# EAGLE design 8-BIT ONE-BUS FLASH CART PRGMER (EAGLE 5.11)
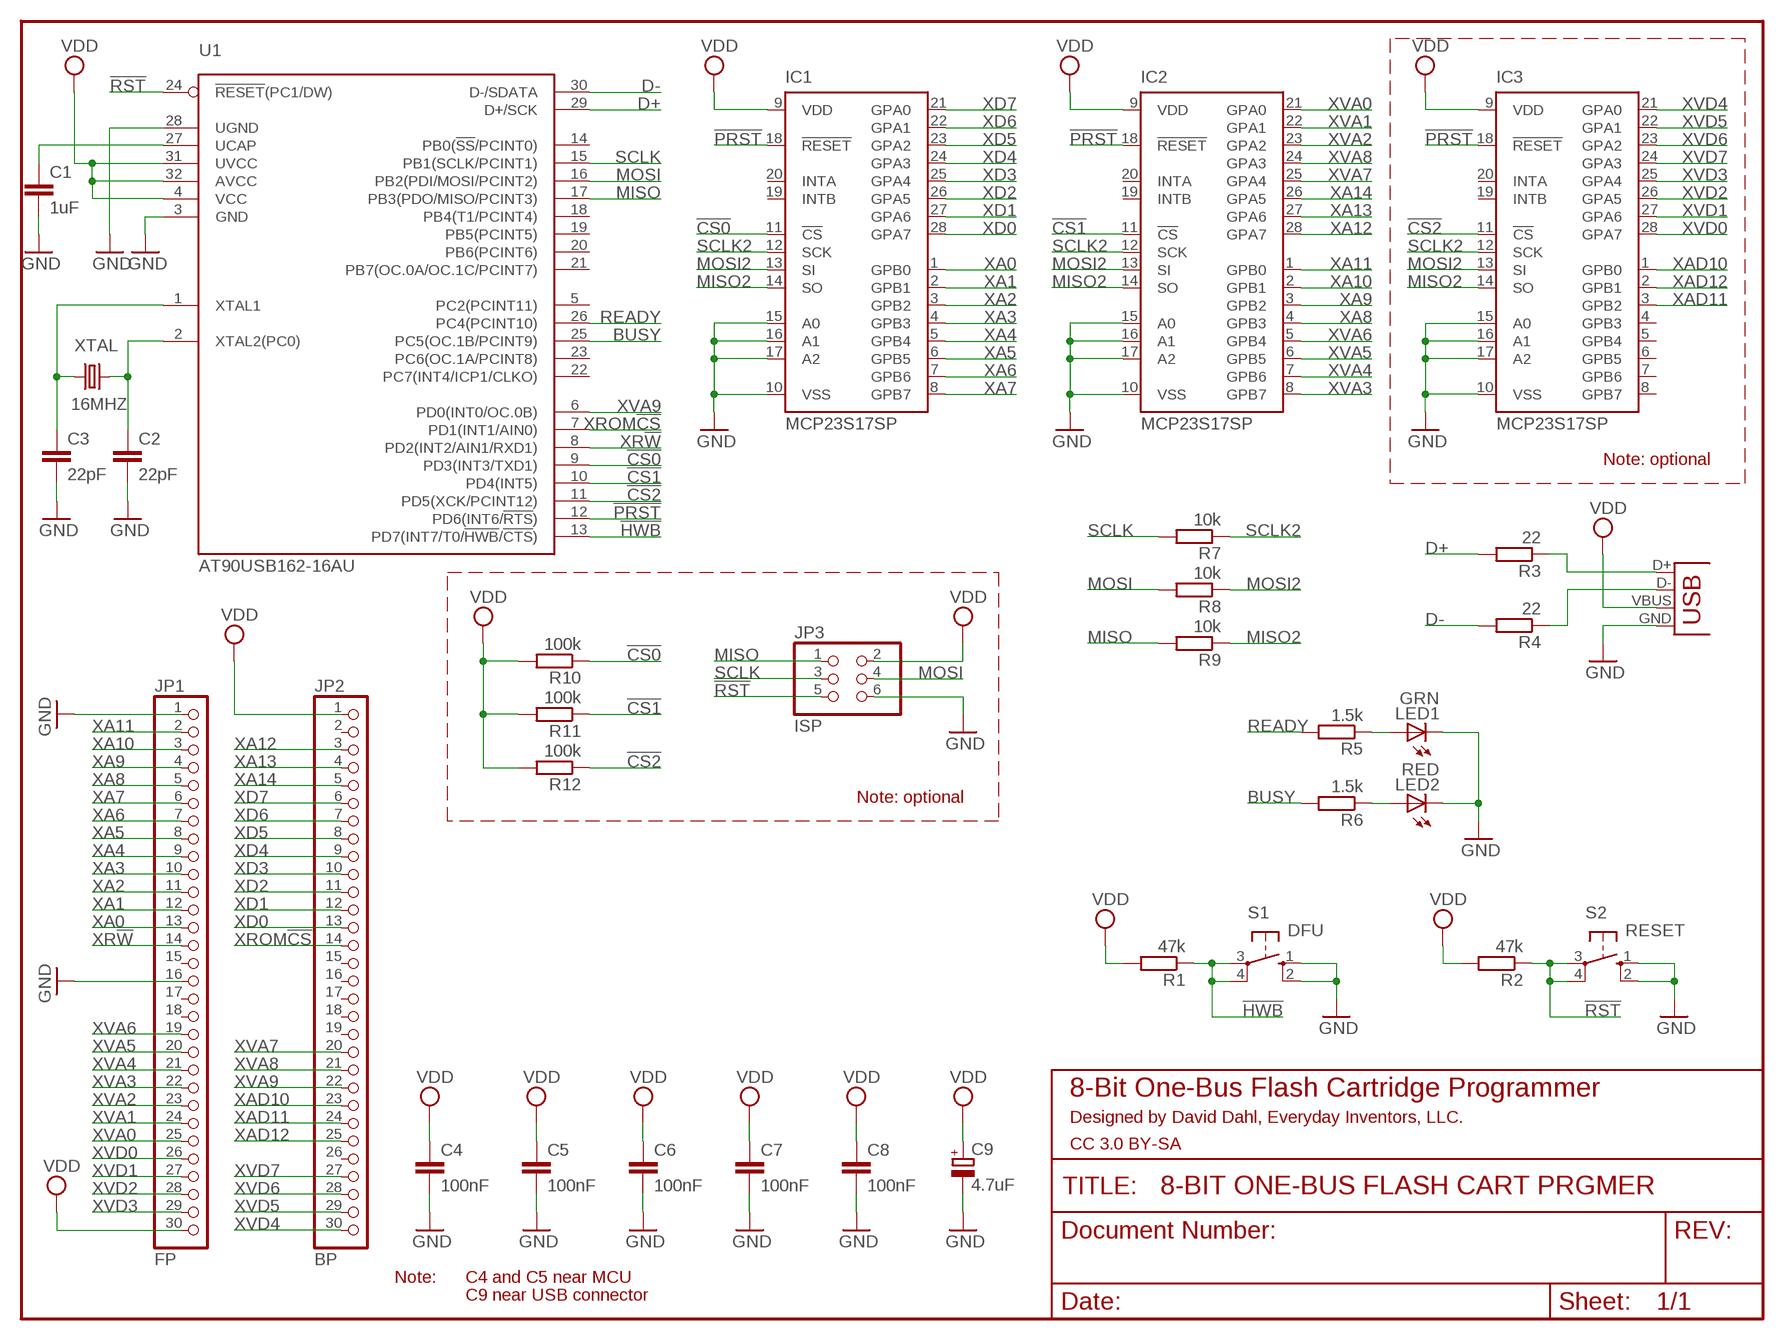
[diagram p0: schematic, sheet 1]

## Parts
C1  1uF  C-EU050-030X075  [C050-030X075]
C2  22pF  C-EU025-024X044  [C025-024X044]
C3  22pF  C-EU025-024X044  [C025-024X044]
C4  100nF  C-EU050-025X075  [C050-025X075]
C5  100nF  C-EU050-025X075  [C050-025X075]
C6  100nF  C-EU050-025X075  [C050-025X075]
C7  100nF  C-EU050-025X075  [C050-025X075]
C8  100nF  C-EU050-025X075  [C050-025X075]
C9  4.7uF  CPOL-EUE5-6  [E5-6]
IC1  MCP23S17SP  [DIL28-3]
IC2  MCP23S17SP  [DIL28-3]
IC3  MCP23S17SP  [DIL28-3]
JP1  FP  PINHD-1X30  [1X30]
JP2  BP  PINHD-1X30  [1X30]
JP3  ISP  PINHD-2X3  [2X03]
LED1  GRN  LED3MM  [LED3MM]
LED2  RED  LED3MM  [LED3MM]
R1  47k  R-EU_0207/10  [0207/10]
R2  47k  R-EU_0207/12  [0207/12]
R3  22  R-EU_0207/7  [0207/7]
R4  22  R-EU_0207/7  [0207/7]
R5  1.5k  R-EU_0207/10  [0207/10]
R6  1.5k  R-EU_0207/10  [0207/10]
R7  10k  R-EU_0207/5V  [0207/5V]
R8  10k  R-EU_0207/5V  [0207/5V]
R9  10k  R-EU_0207/7  [0207/7]
R10  100k  R-EU_0207/7  [0207/7]
R11  100k  R-EU_0207/7  [0207/7]
R12  100k  R-EU_0207/7  [0207/7]
S1  DFU  10-XX  [B3F-10XX]
S2  RESET  10-XX  [B3F-10XX]
U1  AT90USB162-16AU  [VQFP32]
USB  USBPTH  [USB-B-PTH]
XTAL  16MHZ  CRYSTALHC49S  [HC49/S]

## Nets
!CS0: IC1.11(!CS) R10.1 U1.9(PD3(INT3/TXD1))
!CS1: IC2.11(!CS) R11.1 U1.10(PD4(INT5))
!CS2: IC3.11(!CS) R12.1 U1.11(PD5(XCK/PCINT12))
!HWB: R1.1 S1.3(P) S1.4(P1) U1.13(PD7(INT7/T0/!HWB!/!CTS!))
!PRST: IC1.18(!RESET) IC2.18(!RESET) IC3.18(!RESET) U1.12(PD6(INT6/!RTS!))
!RST: JP3.5 R2.1 S2.3(P) S2.4(P1) U1.24(!RESET!(PC1/DW))
BUSY: R6.2 U1.25(PC5(OC.1B/PCINT9))
D+: R3.2 U1.29(D+/SCK)
D-: R4.2 U1.30(D-/SDATA)
GND: C1.2 C2.2 C3.2 C4.2 C5.2 C6.2 C7.2 C8.2 C9.- IC1.10(VSS) IC1.15(A0) IC1.16(A1) IC1.17(A2) IC2.10(VSS) IC2.15(A0) IC2.16(A1) IC2.17(A2) IC3.10(VSS) IC3.15(A0) IC3.16(A1) IC3.17(A2) JP1.1 JP1.16 JP3.6 LED1.K(C) LED2.K(C) S1.1(S) S1.2(S1) S2.1(S) S2.2(S1) U1.3(GND) U1.28(UGND) USB.GND
MISO: JP3.1 R9.2 U1.17(PB3(PDO/MISO/PCINT3))
MISO2: IC1.14(SO) IC2.14(SO) IC3.14(SO) R9.1
MOSI: JP3.4 R8.2 U1.16(PB2(PDI/MOSI/PCINT2))
MOSI2: IC1.13(SI) IC2.13(SI) IC3.13(SI) R8.1
N$1: LED1.A R5.1
N$2: LED2.A R6.1
N$3: R3.1 USB.D+
N$4: R4.1 USB.D-
N$5: C1.1 U1.27(UCAP)
N$6: C2.1 U1.2(XTAL2(PC0)) XTAL.2
N$7: C3.1 U1.1(XTAL1) XTAL.1
READY: R5.2 U1.26(PC4(PCINT10))
SCLK: JP3.3 R7.2 U1.15(PB1(SCLK/PCINT1))
SCLK2: IC1.12(SCK) IC2.12(SCK) IC3.12(SCK) R7.1
VDD: C4.1 C5.1 C6.1 C7.1 C8.1 C9.+ IC1.9(VDD) IC2.9(VDD) IC3.9(VDD) JP1.30 JP2.1 JP3.2 R1.2 R2.2 R10.2 R11.2 R12.2 U1.4(VCC) U1.31(UVCC) U1.32(AVCC) USB.VBUS
XA0: IC1.1(GPB0) JP1.13
XA1: IC1.2(GPB1) JP1.12
XA2: IC1.3(GPB2) JP1.11
XA3: IC1.4(GPB3) JP1.10
XA4: IC1.5(GPB4) JP1.9
XA5: IC1.6(GPB5) JP1.8
XA6: IC1.7(GPB6) JP1.7
XA7: IC1.8(GPB7) JP1.6
XA8: IC2.4(GPB3) JP1.5
XA9: IC2.3(GPB2) JP1.4
XA10: IC2.2(GPB1) JP1.3
XA11: IC2.1(GPB0) JP1.2
XA12: IC2.28(GPA7) JP2.3
XA13: IC2.27(GPA6) JP2.4
XA14: IC2.26(GPA5) JP2.5
XAD10: IC3.1(GPB0) JP2.23
XAD11: IC3.3(GPB2) JP2.24
XAD12: IC3.2(GPB1) JP2.25
XD0: IC1.28(GPA7) JP2.13
XD1: IC1.27(GPA6) JP2.12
XD2: IC1.26(GPA5) JP2.11
XD3: IC1.25(GPA4) JP2.10
XD4: IC1.24(GPA3) JP2.9
XD5: IC1.23(GPA2) JP2.8
XD6: IC1.22(GPA1) JP2.7
XD7: IC1.21(GPA0) JP2.6
XR!W: JP1.14 U1.8(PD2(INT2/AIN1/RXD1))
XROM!CS: JP2.14 U1.7(PD1(INT1/AIN0))
XVA0: IC2.21(GPA0) JP1.25
XVA1: IC2.22(GPA1) JP1.24
XVA2: IC2.23(GPA2) JP1.23
XVA3: IC2.8(GPB7) JP1.22
XVA4: IC2.7(GPB6) JP1.21
XVA5: IC2.6(GPB5) JP1.20
XVA6: IC2.5(GPB4) JP1.19
XVA7: IC2.25(GPA4) JP2.20
XVA8: IC2.24(GPA3) JP2.21
XVA9: JP2.22 U1.6(PD0(INT0/OC.0B))
XVD0: IC3.28(GPA7) JP1.26
XVD1: IC3.27(GPA6) JP1.27
XVD2: IC3.26(GPA5) JP1.28
XVD3: IC3.25(GPA4) JP1.29
XVD4: IC3.21(GPA0) JP2.30
XVD5: IC3.22(GPA1) JP2.29
XVD6: IC3.23(GPA2) JP2.28
XVD7: IC3.24(GPA3) JP2.27
Unconnected: IC1.19(INTB) IC1.20(INTA) IC2.19(INTB) IC2.20(INTA) IC3.4(GPB3) IC3.5(GPB4) IC3.6(GPB5) IC3.7(GPB6) IC3.8(GPB7) IC3.19(INTB) IC3.20(INTA) JP1.15 JP1.17 JP1.18 JP2.2 JP2.15 JP2.16 JP2.17 JP2.18 JP2.19 JP2.26 U1.5(PC2(PCINT11)) U1.14(PB0(!SS!/PCINT0)) U1.18(PB4(T1/PCINT4)) U1.19(PB5(PCINT5)) U1.20(PB6(PCINT6)) U1.21(PB7(OC.0A/OC.1C/PCINT7)) U1.22(PC7(INT4/ICP1/CLKO)) U1.23(PC6(OC.1A/PCINT8))

## Notes on the sheet
- Note: optional
- Note: optional
- 8-Bit One-Bus Flash Cartridge Programmer
- Designed by David Dahl, Everyday Inventors, LLC.
- CC 3.0 BY-SA
- Note: | C4 and C5 near MCU
- C9 near USB connector

## Library data of the parts
C1-C8 = rcl:C-EU: CAPACITOR, European symbol
C9 = rcl:CPOL-EU: POLARIZED CAPACITOR, European symbol
IC1-IC3 = microchip:MCP23S17: http://ww1.microchip.com/downloads/en/DeviceDoc/21952a.pdf Source: http://ww1.microchip.com/downloads/en/DeviceDoc/21952a.pdf
JP1 JP2 = pinhead:PINHD-1X30: PIN HEADER
JP3 = pinhead:PINHD-2X3: PIN HEADER
LED1 LED2 = led:LED: LED OSRAM: - CHIPLED LG R971, LG N971, LY N971, LG Q971, LY Q971, LO R971, LY R971 LH N974, LH R974 LS Q976, LO Q976, LY Q976 LO Q996 - Hyper CHIPLED LW Q18S LB Q993, LB Q99A, LB R99A - SideLED LS A670, LO A670, LY A670, LG A670, LP A670 LB A673, LV A673, LT A673, LW A673 LH A674 LY A675 LS A676, LA A676, LO A676, LY A676, LW A676 LS A679, LY A679, LG A679 - Hyper Micro SIDELED® LS Y876, LA Y876, LO Y876, LY Y876 LT Y87S - SmartLED LW L88C, LW L88S LB L89C, LB L89S, LG L890 LS L89K, LO L89K, LY L89K LS L896, LA L896, LO L896, LY L896 - TOPLED LS T670, LO T670, LY T670, LG T670, LP T670 LSG T670, LSP T670, LSY T670, LOP T670, LYG T670 LG T671, LOG T671, LSG T671 LB T673, LV T673, LT T673, LW T673 LH T674 LS T676, LA T676, LO T676, LY T676, LB T676, LH T676, LSB T676, LW T676 LB T67C, LV T67C, LT T67C, LS T67K, LO T67K, LY T67K, LW E67C LS E67B, LA E67B, LO E67B, LY E67B, LB E67C, LV E67C, LT E67C LW T67C LS T679, LY T679, LG T679 LS T770, LO T770, LY T770, LG T770, LP T770 LB T773, LV T773, LT T773, LW T773 LH T774 LS E675, LA E675, LY E675, LS T675 LS T776, LA T776, LO T776, LY T776, LB T776 LHGB T686 LT T68C, LB T68C - Hyper Mini TOPLED® LB M676 - Mini TOPLED Santana® LG M470 LS M47K, LO M47K, LY M47K Source: http://www.osram.convergy.de LUXEON: - LUMILED® LXK2-PW12-R00, LXK2-PW12-S00, LXK2-PW14-U00, LXK2-PW14-V00 LXK2-PM12-R00, LXK2-PM12-S00, LXK2-PM14-U00 LXK2-PE12-Q00, LXK2-PE12-R00, LXK2-PE12-S00, LXK2-PE14-T00, LXK2-PE14-U00 LXK2-PB12-K00, LXK2-PB12-L00, LXK2-PB12-M00, LXK2-PB14-N00, LXK2-PB14-P00, LXK2-PB14-Q00 LXK2-PR12-L00, LXK2-PR12-M00, LXK2-PR14-Q00, LXK2-PR14-R00 LXK2-PD12-Q00, LXK2-PD12-R00, LXK2-PD12-S00 LXK2-PH12-R00, LXK2-PH12-S00 LXK2-PL12-P00, LXK2-PL12-Q00, LXK2-PL12-R00 Source: www.luxeon.com KINGBRIGHT: KA-3528ASYC Source: www.kingbright.com
R1-R12 = rcl:R-EU_: RESISTOR, European symbol
S1 S2 = switch-omron:10-XX: OMRON SWITCH
U1 = at90usb:AT90USB162-16AU: 8-bit Microcontroller with 16K Bytes ISP Flash and USB Controller
USB = SparkFun:USB: USB Connectors USB-B-PTH is fully proven SKU : PRT-00139 USB-miniB is fully proven SKU : PRT-00587 USB-A-PCB is untested. USB-A-H is throughly reviewed, but untested. Spark Fun Electronics SKU : PRT-00437 USB-B-SMT is throughly reviewed, but untested. Needs silkscreen touching up. USB-A-S has not been used/tested USB-MB-H has not been used/tested
XTAL = crystal:CRYSTAL: CRYSTAL

## Board
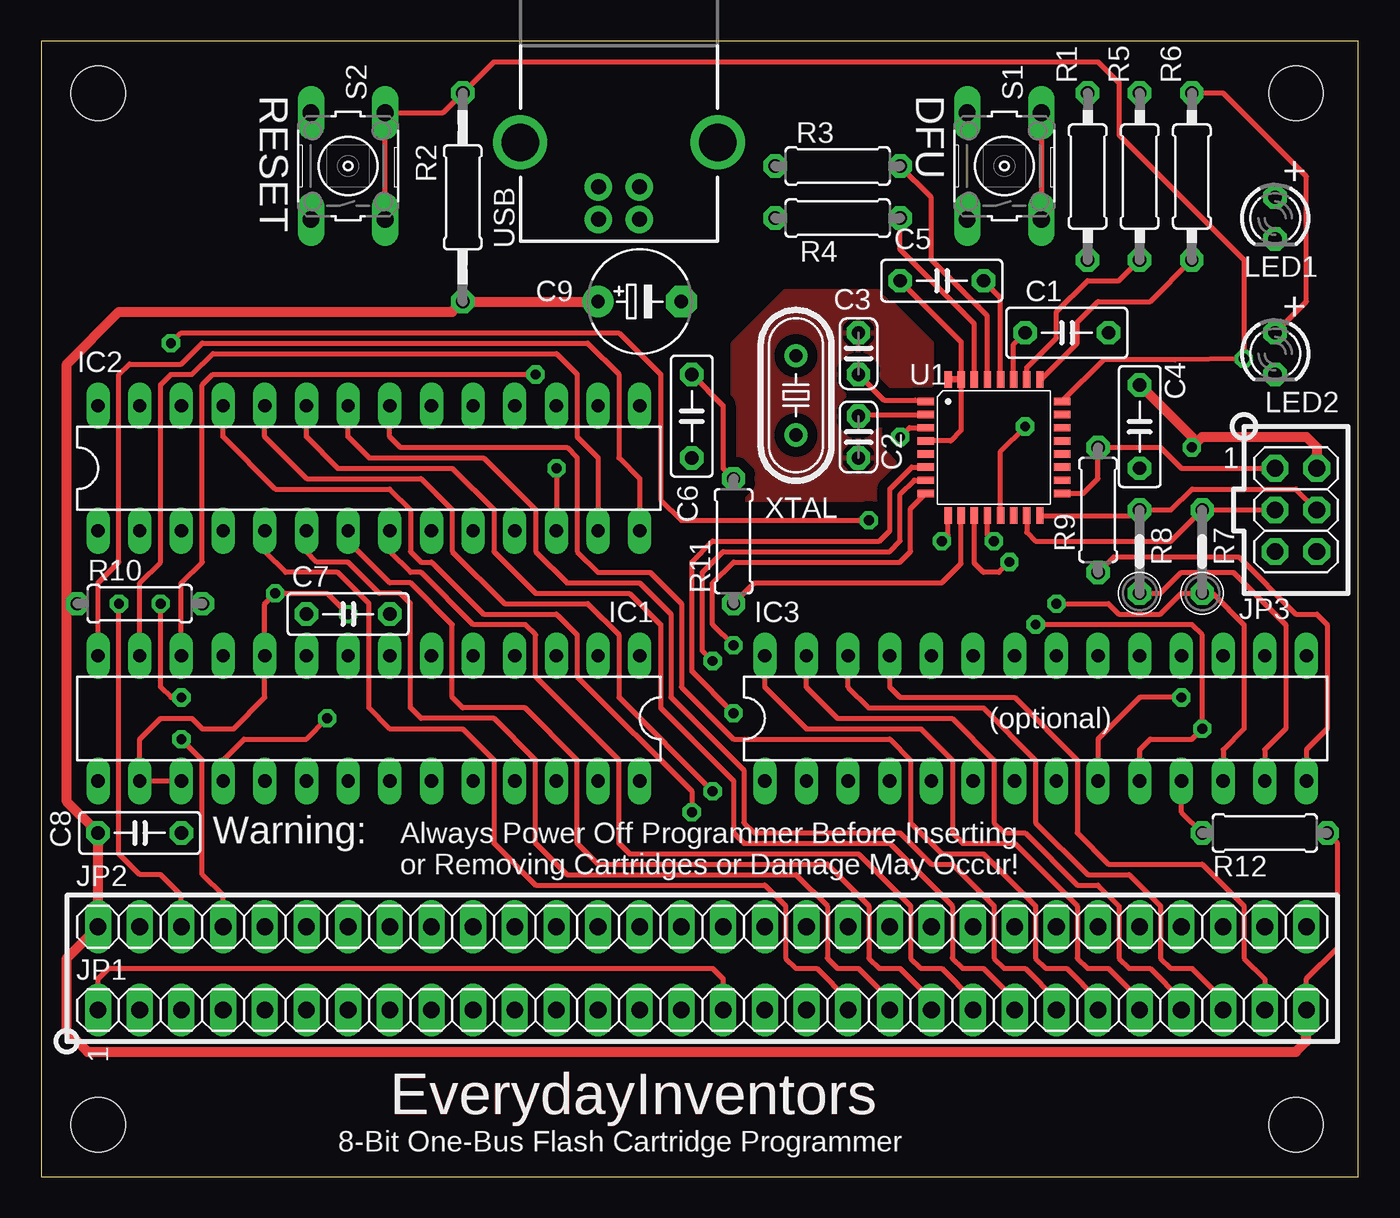
[diagram p1: board, top side]
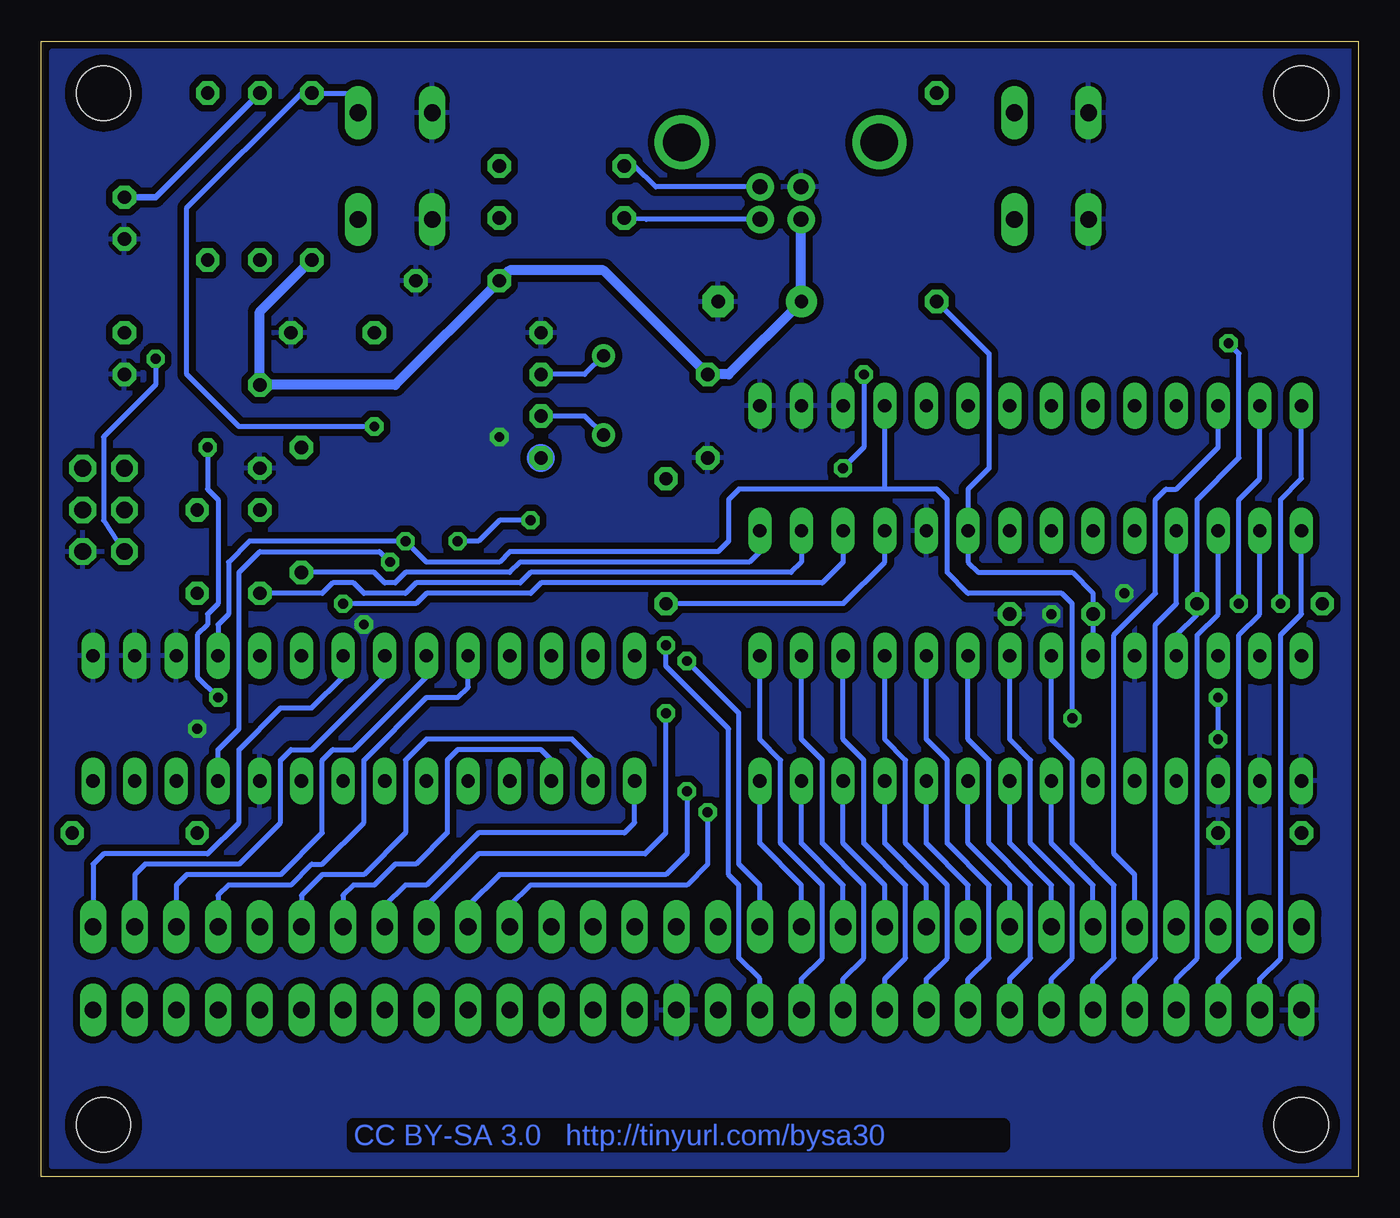
[diagram p2: board, bottom side, seen from below]

Size 80.31 x 69.2 mm. Coordinates in mm from the lower left corner, seen from the top.
Outline: 80.31,69.2 0,69.2 0,0 80.31,0 80.31,69.2
Copper layers (1*16): Top 0.035mm / dielectric 1.5mm / Bottom 0.035mm
Design rules "SparkFun": minimum track width 8mil, minimum drill 20mil, track to track 8mil, track to pad 8mil, pad to pad 8mil, via to via 8mil, smd to smd 8mil, copper to edge 10mil, drill to drill 8mil, minimum pad ring 12mil, minimum via ring 10mil, stop-mask expansion 4mil, vias tented up to drill 25mil, thermal gap 10mil

### Footprints (pad centres in the part's own frame; a part is rotated, then mirrored left to right if it is on the bottom)
C050-030X075 = drill 0.813 octagon: 1 -2.54,0; 2 2.54,0
C025-024X044 = drill 0.813 octagon: 1 -1.27,0; 2 1.27,0
C050-025X075 = drill 0.813 octagon: 1 -2.54,0; 2 2.54,0
E5-6 = drill 0.813 pad 1.905 round: + -2.54,0 | drill 0.813 pad 1.905 octagon: - 2.54,0
DIL28-3 = drill 0.813 long: 1 -16.51,-3.81; 2 -13.97,-3.81; 3 -11.43,-3.81; 4 -8.89,-3.81; 5 -6.35,-3.81; 6 -3.81,-3.81; 7 -1.27,-3.81; 8 1.27,-3.81; 9 3.81,-3.81; 10 6.35,-3.81; 11 8.89,-3.81; 12 11.43,-3.81; 13 13.97,-3.81; 14 16.51,-3.81; 15 16.51,3.81; 16 13.97,3.81; 17 11.43,3.81; 18 8.89,3.81; 19 6.35,3.81; 20 3.81,3.81; 21 1.27,3.81; 22 -1.27,3.81; 23 -3.81,3.81; 24 -6.35,3.81; 25 -8.89,3.81; 26 -11.43,3.81; 27 -13.97,3.81; 28 -16.51,3.81
1X30 = drill 1.016 long: 1 -36.83,0; 2 -34.29,0; 3 -31.75,0; 4 -29.21,0; 5 -26.67,0; 6 -24.13,0; 7 -21.59,0; 8 -19.05,0; 9 -16.51,0; 10 -13.97,0; 11 -11.43,0; 12 -8.89,0; 13 -6.35,0; 14 -3.81,0; 15 -1.27,0; 16 1.27,0; 17 3.81,0; 18 6.35,0; 19 8.89,0; 20 11.43,0; 21 13.97,0; 22 16.51,0; 23 19.05,0; 24 21.59,0; 25 24.13,0; 26 26.67,0; 27 29.21,0; 28 31.75,0; 29 34.29,0; 30 36.83,0
2X03 = drill 1.016 octagon: 1 -2.54,-1.27; 2 -2.54,1.27; 3 0,-1.27; 4 0,1.27; 5 2.54,-1.27; 6 2.54,1.27
LED3MM = drill 0.813 octagon: A -1.27,0; K 1.27,0
0207/10 = drill 0.813 octagon: 1 -5.08,0; 2 5.08,0
0207/12 = drill 0.813 octagon: 1 -6.35,0; 2 6.35,0
0207/7 = drill 0.813 octagon: 1 -3.81,0; 2 3.81,0
0207/5V = drill 0.813 octagon: 1 -2.54,0; 2 2.54,0
B3F-10XX = drill 1.016 long: 1 -3.251,2.261; 2 3.251,2.261; 3 -3.251,-2.261; 4 3.251,-2.261
VQFP32 = smd 1 x 0.45: 1 -4.15,2.8; 2 -4.15,2; 3 -4.15,1.2; 4 -4.15,0.4; 5 -4.15,-0.4; 6 -4.15,-1.2; 7 -4.15,-2; 8 -4.15,-2.8; 17 4.15,-2.8; 18 4.15,-2; 19 4.15,-1.2; 20 4.15,-0.4; 21 4.15,0.4; 22 4.15,1.2; 23 4.15,2; 24 4.15,2.8 | smd 0.45 x 1: 9 -2.8,-4.15; 10 -2,-4.15; 11 -1.2,-4.15; 12 -0.4,-4.15; 13 0.4,-4.15; 14 1.2,-4.15; 15 2,-4.15; 16 2.8,-4.15; 25 2.8,4.15; 26 2,4.15; 27 1.2,4.15; 28 0.4,4.15; 29 -0.4,4.15; 30 -1.2,4.15; 31 -2,4.15; 32 -2.8,4.15
STAND-OFF = hole 3.302: 0,0
USB-B-PTH = drill 0.914 pad 1.676 round: D+ 0,1.25; D- 1.981,1.25; GND 0,-1.25; VBUS 1.981,-1.25 | drill 2.286 round: P$1 -2.718,-6.02; P$2 -2.718,6.02
HC49/S = drill 0.813 round: 1 -2.413,0; 2 2.413,0

### Placement (x,y rotation side)
C1  62.54,51.43 0 top
C2  49.84,45.08 270 top
C3  49.84,50.16 90 top
C4  66.98,45.71 270 top
C5  54.91,54.6 0 top
C6  39.68,46.34 270 top
C7  18.72,34.28 0 top
C8  6.02,20.94 0 top
C9  36.5,53.33 0 top
IC1  19.99,27.93 180 top
IC2  19.99,43.17 0 top
IC3  60.63,27.93 0 top
JP1  40.31,10.15 0 top
JP2  40.31,15.23 0 top
JP3  76.5,40.63 270 top
LED1  75.23,58.41 270 top
LED2  75.23,50.16 270 top
R1  63.81,60.95 270 top
R2  25.71,59.68 270 top
R3  48.57,61.59 0 top
R4  48.57,58.41 0 top
R5  66.98,60.95 270 top
R6  70.16,60.95 270 top
R7  70.79,38.09 90 top
R8  66.98,38.09 90 top
R9  64.44,40.63 90 top
R10  6.02,34.91 180 top
R11  42.22,38.73 90 top
R12  74.6,20.94 0 top
S1  58.73,61.59 90 top
S2  18.72,61.59 90 top
U1  58.09,44.44 0 top
U$1  [STAND-OFF]  76.5,3.17 180 top
U$2  [STAND-OFF]  3.48,3.17 180 top
U$3  [STAND-OFF]  3.48,66.03 180 top
U$4  [STAND-OFF]  76.5,66.03 180 top
USB  35.23,60.32 270 top
XTAL  46.02,47.62 270 top

### Tracks (layer width: path | path; a pad name or v marks a point on that pad's centre or on a via)
!CS0  (via drill 0.6)
  Top 0.305: v7.93,50.79 8.56,51.43 35.23,51.43 37.77,48.89 37.77,41.27 39.04,40 v50.47,40 | U1.9 55.29,39.1 v54.91,38.73
  Bottom 0.305: IC1.11 11.1,33.01 9.83,34.28 R10.1 9.83,41.27 7.29,43.8 7.29,50.16 v7.93,50.79 | v50.47,40 52.38,40 53.65,38.73 v54.91,38.73
!CS1
  Top 0.305: U1.10 56.09,37.36 54.91,36.19 43.48,36.19 R11.1
  Bottom 0.305: IC2.11 28.88,37.46 31.42,34.91 R11.1
!CS2  (via drill 0.6)
  Top 0.305: U1.11 56.89,37.39 57.45,36.82 58.41,36.82 v59.04,37.46 | R12.1 69.52,22.21 IC3.11
  Bottom 0.305: v59.04,37.46 59.68,38.09 66.98,38.09 68.25,36.82 68.25,27.29 69.52,26.02 IC3.11
!HWB  (via drill 0.6)
  Top 0.305: S1.4 S1.3 | U1.13 58.49,44.21 v60,45.71
  Bottom 0.305: v60,45.71 68.25,45.71 71.42,48.89 71.42,59.05 64.44,66.03 R1.1 61.27,66.03 60.99,65.75 S1.4
!PRST  (via drill 0.6)
  Top 0.305: v58.09,38.73 57.69,39.12 U1.12 | v17.45,27.93 16.18,26.66 12.37,26.66 11.1,25.39 IC1.18
  Bottom 0.305: IC3.18 69.52,33.65 68.89,34.28 68.89,37.46 67.61,38.73 v58.09,38.73 56.82,37.46 52.38,37.46 51.74,38.09 39.04,38.09 38.41,38.73 38.41,41.27 37.77,41.9 28.88,41.9 | 28.88,41.9 25.71,41.9 25.07,41.27 25.07,36.82 23.8,35.55 18.09,35.55 17.45,34.91 v17.45,27.93 | 28.88,41.9 IC2.18
!RST  (via drill 0.6)
  Top 0.305: S2.3 S2.4 24.51,64.84 R2.1 27.61,67.93 64.44,67.93 65.71,66.66 65.71,63.49 73.33,55.87 v73.33,49.84 69.14,49.78 64.78,49.78 U1.24
  Bottom 0.305: JP3.5 76.5,40 76.5,45.08 73.33,48.25 v73.33,49.84
BUSY
  Top 0.305: U1.25 60.97,48.59 63.17,50.79 63.17,52.06 64.44,53.33 67.61,53.33 R6.2
D+
  Top 0.305: U1.29 57.69,52.46 54.28,55.87 54.28,59.68 R3.2
D-
  Top 0.305: U1.30 56.89,51.99 52.38,56.51 R4.2
GND  (via drill 0.6)
  Top 0.305: IC1.17 IC1.16 6.02,26.66 7.29,27.93 9.2,27.93 9.83,27.29 11.73,27.29 13.64,29.2 IC1.10 13.64,34.91 v14.28,35.55 17.45,35.55 v18.72,34.28 | JP1.16 41.58,12.05 40.95,12.69 4.12,12.69 3.48,12.05 JP1.1 | IC3.10 66.98,26.02 67.61,26.66 70.16,26.66 v70.79,27.29 70.79,33.01 70.16,33.65 v60.63,33.65 | U1.28 58.49,53.57 C5.2 | v52.38,45.08 52.94,45.64 U1.3
  pour Bottom (isolate 0.406): 79.68,0.62 0.3,0.62 0.3,68.57 79.68,68.57
  pour Top (isolate 0.61): 52.38,43.17 52.38,41.27 42.22,41.27 42.22,50.79 45.39,53.97 51.11,53.97 54.28,50.79 54.28,48.25 52.38,46.98 51.74,46.98 51.11,46.34 51.11,44.44
MISO
  Top 0.305: U1.17 63.55,41.64 64.44,42.54 R9.2 68.25,44.44 69.52,43.17 JP3.1
MISO2
  Top 0.305: IC2.14 36.5,42.54 35.23,43.8 35.23,48.89 33.33,50.79 9.83,50.79 8.56,49.52 5.38,49.52 4.75,48.89 4.75,37.46 3.48,36.19 IC1.14 | R9.1 65.39,37.77 73.01,37.77 76.5,34.28 77.78,34.28 78.41,33.65 78.41,27.29 77.14,26.02 IC3.14
  Bottom 0.305: R9.1 60,36.82 59.36,36.19 58.73,36.19 58.09,36.82 51.74,36.82 51.11,37.46 37.14,37.46 36.5,38.09 IC2.14
MOSI
  Top 0.305: JP3.4 76.5,41.9 70.16,41.9 68.89,40.63 R8.2 66.64,40.29 U1.16
MOSI2
  Top 0.305: IC2.13 33.96,43.8 32.69,45.08 32.69,48.89 31.42,50.16 10.46,50.16 9.2,48.89 7.93,48.89 7.29,48.25 7.29,37.46 6.02,36.19 IC1.13 | R8.1 68.25,35.55 69.52,36.82 72.7,36.82 75.87,33.65 75.87,27.29 74.6,26.02 IC3.13
  Bottom 0.305: R8.1 63.17,35.55 62.54,36.19 61.27,36.19 60.63,35.55 58.09,35.55 57.45,36.19 51.11,36.19 50.47,36.82 34.59,36.82 33.96,37.46 IC2.13
N$1
  Bottom 0.406: R5.1 73.33,59.68 LED1.A
N$2
  Top 0.305: R6.1 72.06,66.03 77.14,60.95 77.14,53.33 LED2.A
N$3
  Bottom 0.305: USB.D+ 42.85,60.32 44.12,61.59 R3.1
N$4
  Bottom 0.305: R4.1 43.41,58.33 USB.D-
N$5
  Top 0.305: U1.27 59.29,50.72 C1.1
N$6
  Top 0.305: U1.2 49.84,46.44 C2.1
  Bottom 0.305: C2.1 47.17,46.34 XTAL.2
N$7
  Top 0.305: U1.1 53.3,47.32 51.4,47.32 C3.1
  Bottom 0.305: C3.1 47.17,48.89 XTAL.1
READY
  Top 0.305: 60.09,48.34 U1.26 60.09,49.3 61.9,51.11 61.9,52.7 63.81,54.6 65.71,54.6 R5.2
SCLK
  Top 0.305: U1.15 60.09,39.27 60.63,38.73 68.89,38.73 R7.2 JP3.3
SCLK2  (via drill 0.6)
  Top 0.305: v30.15,48.89 10.46,48.89 9.83,48.25 9.83,37.46 8.56,36.19 IC1.12 | v31.42,43.17 IC2.12 | IC3.12 72.06,26.02 73.33,27.29 73.33,33.65 71.42,35.55 R7.1 69.52,35.55 68.25,34.28 65.71,34.28 65.08,34.91 v61.9,34.91
  Bottom 0.305: v31.42,43.17 30.15,44.44 v30.15,48.89 | v61.9,34.91 57.45,34.91 56.82,35.55 50.47,35.55 49.84,36.19 32.69,36.19 31.42,37.46 IC2.12
VDD  (via drill 0.6)
  Top 0.305: IC3.9 64.44,26.66 66.98,29.2 v69.52,29.2 | C5.1 56.09,50.89 U1.31 56.09,45.48 55.45,44.84 U1.4 | R11.2 41.58,43.17 41.58,46.98 C6.1 | R12.2 79.05,20.31 79.05,13.96 77.14,12.05 JP1.30
  Top 0.406: U1.31 U1.32 | 1.57,34.91 R10.2
  Top 0.61: JP1.30 77.14,8.25 76.5,7.61 2.84,7.61 1.57,8.88 1.57,13.33 JP2.1 C8.1 1.57,22.85 1.57,34.91 1.57,49.52 4.75,52.7 25.07,52.7 R2.2 C9.+ | JP3.2 77.78,44.44 77.14,45.08 70.79,45.08 v70.16,44.44 70.16,45.08 C4.1
  Bottom 0.305: v69.52,29.2 70.79,30.47 70.79,33.01 70.16,33.65 70.16,34.28 69.52,34.91 69.52,41.27 70.16,41.9 v70.16,44.44 | IC1.9 C7.1 16.18,35.55 17.45,36.82 23.17,36.82 23.8,37.46 IC2.9 23.8,41.9 22.53,43.17 22.53,50.16 R2.2
  Bottom 0.61: R1.2 66.98,52.7 C4.1 58.73,48.25 C5.1 51.74,55.23 46.02,55.23 C6.1 38.41,48.89 C9.+ 33.98,53.33 USB.VBUS
XA0
  Bottom 0.305: IC1.1 36.5,26.66 35.23,25.39 35.23,20.31 32.69,17.77 32.69,13.33 33.96,12.05 JP1.13
XA1
  Bottom 0.305: IC1.2 33.96,26.66 32.69,25.39 32.69,20.31 30.15,17.77 30.15,13.33 31.42,12.05 JP1.12
XA2
  Bottom 0.305: IC1.3 31.42,26.66 30.15,25.39 30.15,20.31 27.61,17.77 27.61,13.33 28.88,12.05 JP1.11
XA3
  Bottom 0.305: IC1.4 28.88,26.66 27.61,25.39 27.61,20.31 25.07,17.77 25.07,13.33 26.34,12.05 JP1.10
XA4
  Bottom 0.305: IC1.5 26.34,26.66 25.07,25.39 25.07,20.31 22.53,17.77 22.53,13.33 23.8,12.05 JP1.9
XA5
  Bottom 0.305: IC1.6 23.8,26.66 22.53,25.39 22.53,20.31 19.99,17.77 19.99,13.33 21.26,12.05 JP1.8
XA6
  Bottom 0.305: IC1.7 21.26,26.66 19.99,25.39 19.99,20.31 17.45,17.77 17.45,13.33 18.72,12.05 JP1.7
XA7
  Bottom 0.305: IC1.8 18.72,26.66 17.45,25.39 17.45,20.31 14.91,17.77 14.91,13.33 16.18,12.05 JP1.6
XA8
  Bottom 0.305: IC2.4 11.1,34.91 12.37,33.65 12.37,13.33 13.64,12.05 JP1.5
XA9
  Bottom 0.305: IC2.3 8.56,34.28 9.83,33.01 9.83,13.33 11.1,12.05 JP1.4
XA10
  Bottom 0.305: IC2.2 6.02,34.28 7.29,33.01 7.29,13.33 8.56,12.05 JP1.3
XA11
  Bottom 0.305: IC2.1 3.48,34.28 4.75,33.01 4.75,13.33 6.02,12.05 JP1.2
XA12  (via drill 0.6)
  Top 0.305: v4.75,34.91 4.75,19.67 6.02,18.4 7.29,18.4 8.56,17.13 JP2.3
  Bottom 0.305: IC2.28 3.48,42.54 4.75,41.27 v4.75,34.91
XA13  (via drill 0.6)
  Top 0.305: v7.29,34.91 7.29,29.83 7.93,29.2 v8.56,29.2 | v8.56,26.66 9.83,25.39 9.83,18.4 11.1,17.13 JP2.4
  Bottom 0.305: IC2.27 6.02,42.54 7.29,41.27 v7.29,34.91 | v8.56,26.66 v8.56,29.2
XA14
  Bottom 0.305: IC2.26 8.56,44.44 11.1,41.9 11.73,41.9 12.37,41.27 12.37,35.55 14.91,33.01 14.91,19.67 13.64,18.4 JP2.5
XAD10
  Bottom 0.305: IC3.1 44.12,21.58 44.76,20.94 53.65,20.94 56.82,17.77 58.09,17.77 59.36,16.5 JP2.23
XAD11
  Bottom 0.305: IC3.3 49.2,25.39 49.84,26.02 54.91,26.02 55.55,25.39 55.55,20.94 57.45,19.04 58.73,19.04 60,17.77 61.27,17.77 61.9,17.13 JP2.24
XAD12
  Bottom 0.305: IC3.2 46.66,25.39 47.93,26.66 56.82,26.66 58.09,25.39 58.09,20.94 60.63,18.4 63.17,18.4 64.44,17.13 JP2.25
XD0
  Bottom 0.305: IC1.28 36.5,20.31 33.96,17.77 JP2.13
XD1
  Bottom 0.305: IC1.27 33.96,20.31 31.42,17.77 JP2.12
XD2
  Bottom 0.305: IC1.26 31.42,20.31 28.88,17.77 JP2.11
XD3
  Bottom 0.305: IC1.25 28.88,20.31 26.34,17.77 JP2.10
XD4
  Bottom 0.305: IC1.24 26.34,20.31 23.8,17.77 JP2.9
XD5
  Bottom 0.305: IC1.23 23.8,20.31 21.26,17.77 JP2.8
XD6
  Bottom 0.305: IC1.22 21.26,20.31 18.72,17.77 JP2.7
XD7
  Bottom 0.305: IC1.21 18.72,20.31 16.18,17.77 JP2.6
XR!W  (via drill 0.6)
  Top 0.305: U1.8 53.01,40.71 53.01,38.09 52.38,37.46 42.22,37.46 40.95,36.19 40.95,33.65 v42.22,32.38
  Bottom 0.305: v42.22,32.38 42.22,31.1 38.41,27.29 38.41,18.4 37.77,17.77 37.77,13.33 36.5,12.05 JP1.14
XROM!CS  (via drill 0.6)
  Top 0.305: U1.7 53.23,42.44 52.38,41.58 52.38,38.73 51.74,38.09 41.58,38.09 40.31,36.82 40.31,32.06 v40.95,31.42
  Bottom 0.305: v40.95,31.42 37.77,28.25 37.77,19.04 36.5,17.77 JP2.14
XVA0
  Top 0.305: IC2.21 21.26,45.08 21.9,44.44 32.05,44.44 32.69,43.8 32.69,38.09 33.96,36.82 37.14,36.82 39.04,34.91 39.04,29.83 42.22,26.66 51.74,26.66 53.01,25.39 53.01,21.58 54.91,19.67 57.45,19.67 60.63,16.5 60.63,13.33 61.27,12.69 62.54,12.69 64.44,10.79 JP1.25
XVA1
  Top 0.305: IC2.22 18.72,45.08 19.99,43.8 26.98,43.8 30.15,40.63 30.15,38.09 32.05,36.19 36.5,36.19 38.41,34.28 38.41,29.2 42.85,24.75 42.85,21.58 43.48,20.94 52.38,20.94 54.28,19.04 55.55,19.04 58.09,16.5 58.09,13.33 58.73,12.69 60,12.69 61.9,10.79 JP1.24
XVA2
  Top 0.305: IC2.23 16.18,45.08 18.09,43.17 25.07,43.17 27.61,40.63 27.61,38.09 30.15,35.55 35.87,35.55 37.77,33.65 37.77,28.56 42.22,24.12 42.22,20.94 42.85,20.31 51.74,20.31 55.55,16.5 55.55,13.33 56.19,12.69 57.45,12.69 59.36,10.79 JP1.23
XVA3
  Top 0.305: IC2.8 21.26,38.09 22.53,36.82 23.17,36.82 26.34,33.65 29.52,33.65 30.15,33.01 30.15,30.47 35.23,25.39 35.23,20.31 35.87,19.67 49.84,19.67 53.01,16.5 53.01,13.33 53.65,12.69 54.91,12.69 56.82,10.79 JP1.22
XVA4
  Top 0.305: JP1.21 54.28,10.79 52.38,12.69 51.11,12.69 50.47,13.33 50.47,16.5 47.93,19.04 33.96,19.04 32.69,20.31 32.69,25.39 29.52,28.56 25.71,28.56 25.07,29.2 25.07,33.65 22.53,36.19 21.26,36.19 18.72,38.73 IC2.7
XVA5
  Top 0.305: IC2.6 16.18,38.09 16.82,37.46 18.72,37.46 20.62,35.55 21.9,35.55 22.53,34.91 22.53,28.56 23.17,27.93 27.61,27.93 30.15,25.39 30.15,20.31 32.05,18.4 46.02,18.4 47.93,16.5 47.93,13.33 48.57,12.69 49.84,12.69 51.74,10.79 JP1.20
XVA6
  Top 0.305: IC2.5 13.64,38.09 14.91,36.82 18.09,36.82 19.99,34.91 19.99,28.56 21.26,27.29 25.71,27.29 27.61,25.39 27.61,20.31 30.15,17.77 44.12,17.77 45.39,16.5 45.39,13.33 46.02,12.69 47.3,12.69 49.2,10.79 JP1.19
XVA7  (via drill 0.6)
  Top 0.305: IC2.25 11.1,45.08 14.28,41.9 21.26,41.9 22.53,40.63 22.53,38.09 23.17,37.46 23.8,37.46 26.98,34.28 31.42,34.28 32.69,33.01 32.69,30.47 39.68,23.48 v39.68,22.21
  Bottom 0.305: v39.68,22.21 39.68,19.04 40.95,17.77 50.47,17.77 51.74,16.5 JP2.20
XVA8  (via drill 0.6)
  Top 0.305: IC2.24 13.64,45.08 16.18,42.54 23.17,42.54 25.07,40.63 25.07,38.09 28.25,34.91 33.33,34.91 35.23,33.01 35.23,29.2 v40.95,23.48
  Bottom 0.305: v40.95,23.48 40.95,19.67 42.22,18.4 52.38,18.4 54.28,16.5 JP2.21
XVA9  (via drill 0.6)
  Top 0.305: U1.6 53.08,43.24 51.74,41.9 51.74,39.36 51.11,38.73 40.95,38.73 39.68,37.46 39.68,30.79 v42.22,28.25
  Bottom 0.305: v42.22,28.25 42.22,20.94 43.48,19.67 53.65,19.67 56.82,16.5 JP2.22
XVD0
  Top 0.305: IC3.28 44.12,29.83 46.66,27.29 53.65,27.29 55.55,25.39 55.55,20.94 56.19,20.31 59.36,20.31 63.17,16.5 63.17,13.33 63.81,12.69 65.08,12.69 66.98,10.79 JP1.26
XVD1
  Top 0.305: IC3.27 46.66,29.83 48.57,27.93 55.55,27.93 58.09,25.39 58.09,21.58 58.73,20.94 60,20.94 63.17,17.77 64.44,17.77 65.71,16.5 65.71,13.33 66.34,12.69 67.61,12.69 69.52,10.79 JP1.27
XVD2
  Top 0.305: IC3.26 49.2,29.83 50.47,28.56 57.45,28.56 60.63,25.39 60.63,21.58 63.81,18.4 66.34,18.4 68.25,16.5 68.25,13.33 68.89,12.69 70.16,12.69 72.06,10.79 JP1.28
XVD3
  Top 0.305: IC3.25 51.74,29.83 52.38,29.2 59.36,29.2 63.17,25.39 63.17,20.94 65.08,19.04 70.79,19.04 73.33,16.5 73.33,13.33 74.6,12.05 JP1.29
XVD4
  Bottom 0.305: IC3.21 61.9,30.47 63.81,28.56 65.71,28.56 68.25,26.02 68.25,21.58 70.16,19.67 76.5,19.67 77.14,19.04 JP2.30
XVD5
  Bottom 0.305: IC3.22 59.36,30.47 63.81,26.02 65.08,26.02 65.71,25.39 65.71,21.58 68.25,19.04 73.97,19.04 74.6,18.4 JP2.29
XVD6
  Bottom 0.305: IC3.23 56.82,30.47 61.27,26.02 62.54,26.02 63.17,25.39 63.17,20.94 65.71,18.4 71.42,18.4 72.06,17.77 JP2.28
XVD7
  Bottom 0.305: IC3.24 54.28,29.83 54.91,29.2 56.82,29.2 60.63,25.39 60.63,21.58 63.17,19.04 63.81,19.04 65.08,17.77 68.89,17.77 69.52,17.13 JP2.27
(copper drawn outside any net)
  shapes: Bottom circle x1

### Text on the board
Top: EverydayInventors
Bottom: CC BY-SA 3.0 http://tinyurl.com/bysa30
tPlace: Warning: | Always Power Off Programmer Before Inserting | or Removing Cartridges or Damage May Occur! | 1 | EverydayInventors | 8-Bit One-Bus Flash Cartridge Programmer
tNames: + | USB | + | 1 | (optional)